# Altium schematic sheet 5V_3V3_LDO.SchDoc
size A; SheetNumber: 6; SheetTotal: 10
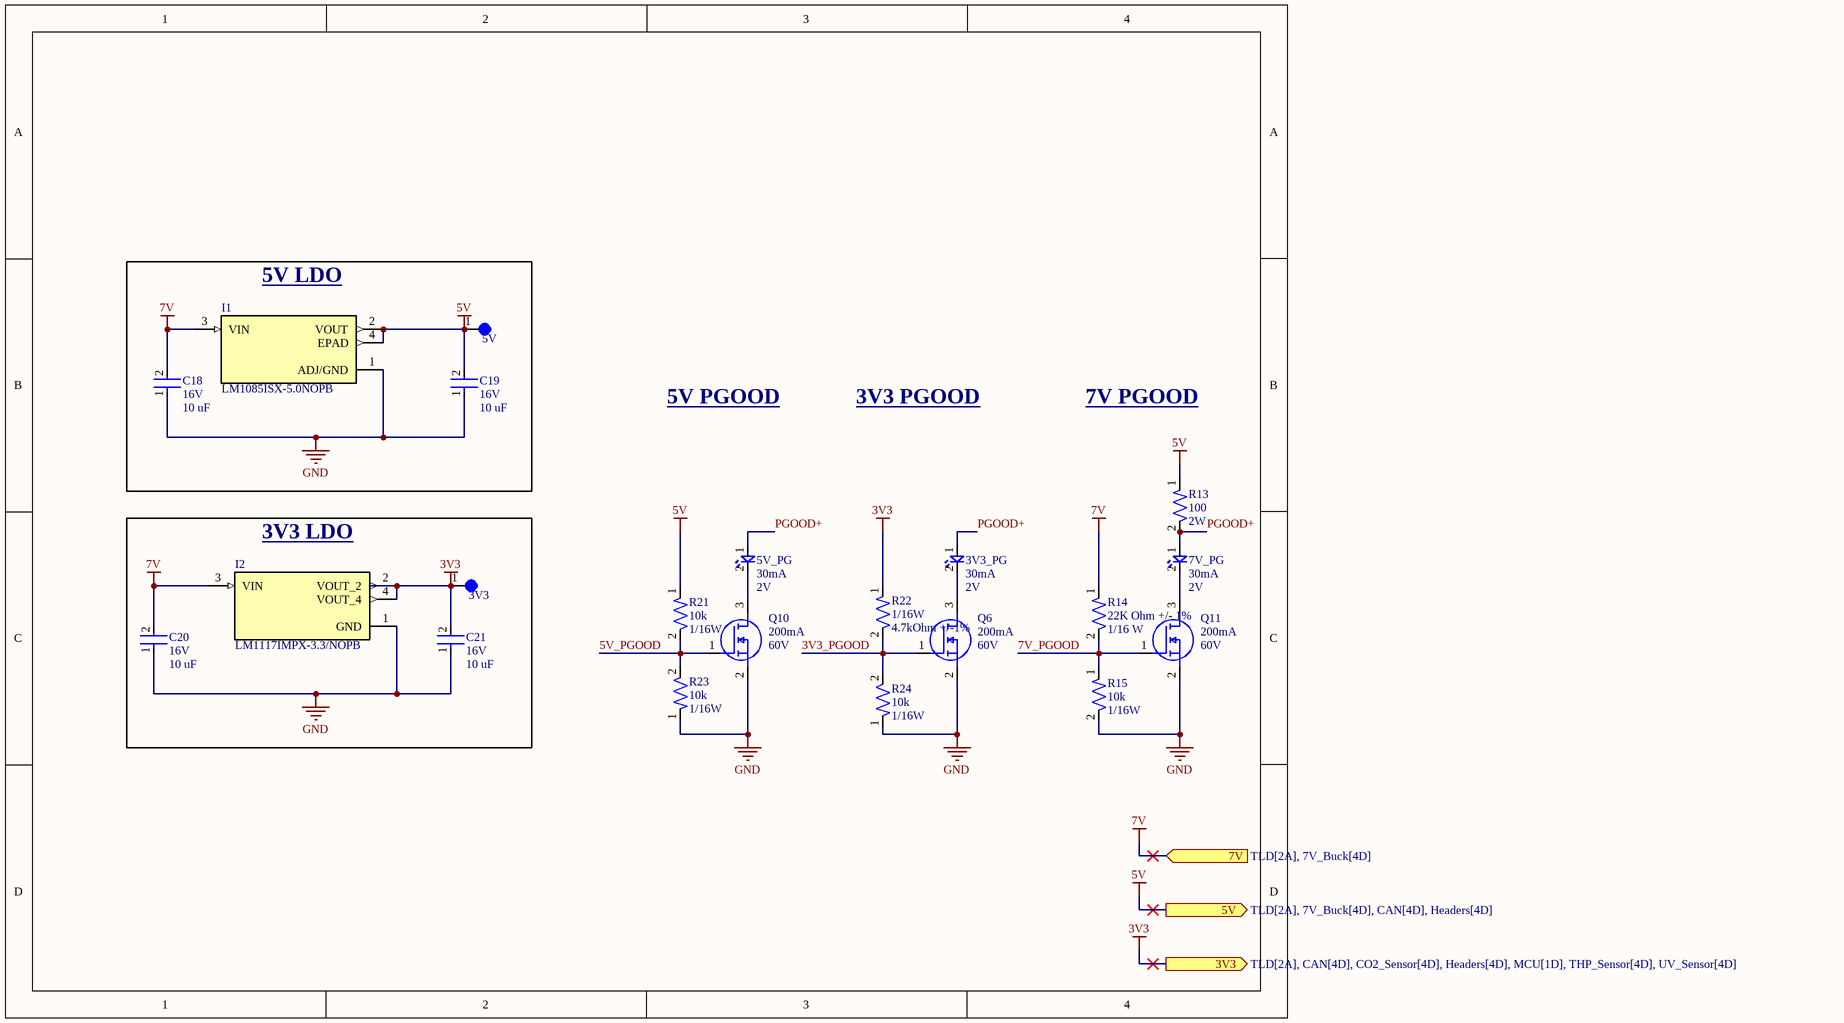
[diagram p0: 5V_3V3_LDO.SchDoc]

## Parts
3V3  5003  [TEST-POINT-0001]  (value not drawn)
3V3_PG  Forward Current: 30mA  Forward Voltage: 2V  [LED-0603]  (hidden comment: BL-HKC36G-AV-TRB)
5V  5003  [TEST-POINT-0001]  (value not drawn)
5V_PG  Forward Current: 30mA  Forward Voltage: 2V  [LED-0603]  (hidden comment: BL-HKC36G-AV-TRB)
7V_PG  Forward Current: 30mA  Forward Voltage: 2V  [LED-0603]  (hidden comment: BL-HKC36G-AV-TRB)
C18  Voltage: 16V  Capacitance: 10 uF  [CAP-1206]  (hidden comment: 293D106X9016A2TE3)
C19  Voltage: 16V  Capacitance: 10 uF  [CAP-1206]  (hidden comment: 293D106X9016A2TE3)
C20  Voltage: 16V  Capacitance: 10 uF  [CAP-1206]  (hidden comment: 293D106X9016A2TE3)
C21  Voltage: 16V  Capacitance: 10 uF  [CAP-1206]  (hidden comment: 293D106X9016A2TE3)
I1  LM1085ISX-5.0NOPB  [IC-TO-263-4]
I2  LM1117IMPX-3.3/NOPB  [IC-SOT-223-4]
Q6  Continuous Current: 200mA  Voltage: 60V  [IC-SOT23-3]  (hidden comment: T2N7002AK,LM)
Q10  Continuous Current: 200mA  Voltage: 60V  [IC-SOT23-3]  (hidden comment: T2N7002AK,LM)
Q11  Continuous Current: 200mA  Voltage: 60V  [IC-SOT23-3]  (hidden comment: T2N7002AK,LM)
R13  Resistance: 100  Power: 2W  [RESC6331X65N]  (hidden comment: SR2512JK-7W100RL)
R14  Resistance: 22K Ohm +/- 1%  Power: 1/16 W  [RES-0402]  (hidden comment: AC0402FR-0722KL)
R15  Resistance: 10k  Power: 1/16W  [RES-0402]  (hidden comment: RC0402FR-0710KL)
R21  Resistance: 10k  Power: 1/16W  [RES-0402]  (hidden comment: RC0402FR-0710KL)
R22  Power Rating: 1/16W  Resistance: 4.7kOhm +/-1%  [RES-0402]  (hidden comment: RC0402FR-074K7P)
R23  Resistance: 10k  Power: 1/16W  [RES-0402]  (hidden comment: RC0402FR-0710KL)
R24  Resistance: 10k  Power: 1/16W  [RES-0402]  (hidden comment: RC0402FR-0710KL)

## Blocks framed on the sheet
5V LDO: 5V C18 C19 I1
3V3 LDO: 3V3 C20 C21 I2

## Ports
3V3 (out, see TLD[2A], CAN[4D], CO2_Sensor[4D], Headers[4D], MCU[1D], THP_Sensor[4D], UV_Sensor[4D]), 5V (out, see TLD[2A], 7V_Buck[4D], CAN[4D], Headers[4D]), 7V (in, see TLD[2A], 7V_Buck[4D])

## Nets
3V3: 3V3.1 C21.2 I2.2(VOUT_2) I2.4(VOUT_4) R22.1 ; port 3V3
5V: 5V.1 C19.2 I1.2(VOUT) I1.4(EPAD) R13.1 R21.1 ; port 5V
7V: C18.2 C20.2 I1.3(VIN) I2.3(VIN) R14.1 ; port 7V
GND: C18.1 C19.1 C20.1 C21.1 I1.1(ADJ/GND) I2.1(GND) Q6.2(S) Q10.2(S) Q11.2(S) R15.2 R23.1 R24.1
3V3_PGOOD: Q6.1(G) R22.2 R24.2
5V_PGOOD: Q10.1(G) R21.2 R23.2
7V_PGOOD: Q11.1(G) R14.2 R15.1
PGOOD+: 3V3_PG.1 5V_PG.1 7V_PG.1 R13.2
Net3V3_PG_2: 3V3_PG.2 Q6.3(D)
Net5V_PG_2: 5V_PG.2 Q10.3(D)
Net7V_PG_2: 7V_PG.2 Q11.3(D)

## Notes on the sheet
- 5V PGOOD
- 3V3 PGOOD
- 7V PGOOD

## Library data of the parts
3V3 5V = TEST-POINT-0001: Oranange PC Test Point, Miniature Phoisphor Bronze Silver Plating Through Hole Mounting Type
3V3_PG 5V_PG 7V_PG = LED-0001: LED YELLOW CLEAR 0603 SMD; ComponentLink1Description: Datasheet; ComponentLink1URL: https://www.americanbrightled.com/pdffiles/led-components/smt/BL-HKC36G-AV-TRB.pdf
C18-C21 = CAP-10U-0004: CAP TANT 10UF 10% 16V 1206; Device Class: Tantalum; Size: 1206; ComponentLink1Description: Datasheet; ComponentLink1URL: https://www.lcsc.com/datasheet/lcsc_datasheet_2304140030_Vishay-Intertech-293D106X9016A2TE3_C110038.pdf
I1 = IC_LDO_5V_0002: IC REG LIN 5V 3A DDPAK/TO263-3; Mfr_Name: Texas Instruments; RefDes: RefDes; Type: Type; ComponentLink1Description: Datasheet; ComponentLink1URL: https://www.ti.com/lit/ds/symlink/lm1085.pdf?HQS=dis-dk-null-digikeymode-dsf-pf-null-wwe&ts=1729859809163&ref_url=https%253A%252F%252Fwww.ti.com%252Fgeneral%252Fdocs%252Fsuppproductinfo.tsp%253FdistId%253D10%2526gotoUrl%253Dhttps%253A%252F%252Fwww.ti.com%252Flit%252Fgpn%252Flm1085
I2 = IC_LDO_3V3_0001: IC REG LIN 3.3V 800MA SOT223-4; ComponentLink1Description: New link; ComponentLink1URL: https://www.ti.com/lit/ds/symlink/lm1117.pdf?HQS=dis-dk-null-digikeymode-dsf-pf-null-wwe&ts=1721700739746
Q6 Q10 Q11 = NMOS-200MA-0001: MOSFET N-CH 60V 200MA SOT23; ComponentLink1Description: Datasheet; ComponentLink1URL: https://toshiba.semicon-storage.com/info/T2N7002AK_datasheet_en_20150401.pdf?did=29712&prodName=T2N7002AK
R13 = RES-100-0002: 100 Ohms ±5% 2W Chip Resistor 2512 (6332 Metric) Automotive AEC-Q200, Pulse Withstanding Thick Film; MF: {'manufacturer': u'YAGEO'}; Package: None; Price: None; Value: *; MP: SR2512JK-7W100RL; Availability: Unavailable; ComponentLink1Description: Datasheet; ComponentLink1URL: https://www.yageogroup.com/content/Resource%20Library/Datasheet/PYU-SR_20105_ROHS_L.pdf
R14 = RES-22K-0002-JLC: 62.5mW Thick Film Resistors 50V ±100ppm/℃ ±1% -55℃~+155℃ 22kΩ 0402  Chip Resistor - Surface Mount ROHS; assembled?: yes; JLC part number: C144778
R15 R21 R23 R24 = RES-10k-0001: RES 10K OHM 1% 1/16W 0402; Tolerance: 1%; Size: 0402; ComponentLink1Description: Datasheet; ComponentLink1URL: https://www.yageo.com/upload/media/product/products/datasheet/rchip/PYu-RC_Group_51_RoHS_L_12.pdf
R22 = RES-4.7K-0001: RES SMD 4.7K OHM 1% 1/16W 0402; Manufacturer: YAGEO; Assembled?: no; Manufacturer Part Number: RC0402FR-074K7P; Package Size: 0402